# Altium schematic sheet CameraCageBB.SchDoc: CameraCageBB
size B; Date: 10/05/2022; Author: Jonah Mikesell; Organization: ORGANIZATION; Address1: ADDRESS 1; Address2: ADDRESS 2; Address3: ADDRESS 3; Address4: ADDRESS 4; Revision: 0; SheetNumber: 1; SheetTotal: 1; ENG_APP_DATE: --/--/--; DSN_APP_DATE: --/--/--; CHK_APP_DATE: --/--/--
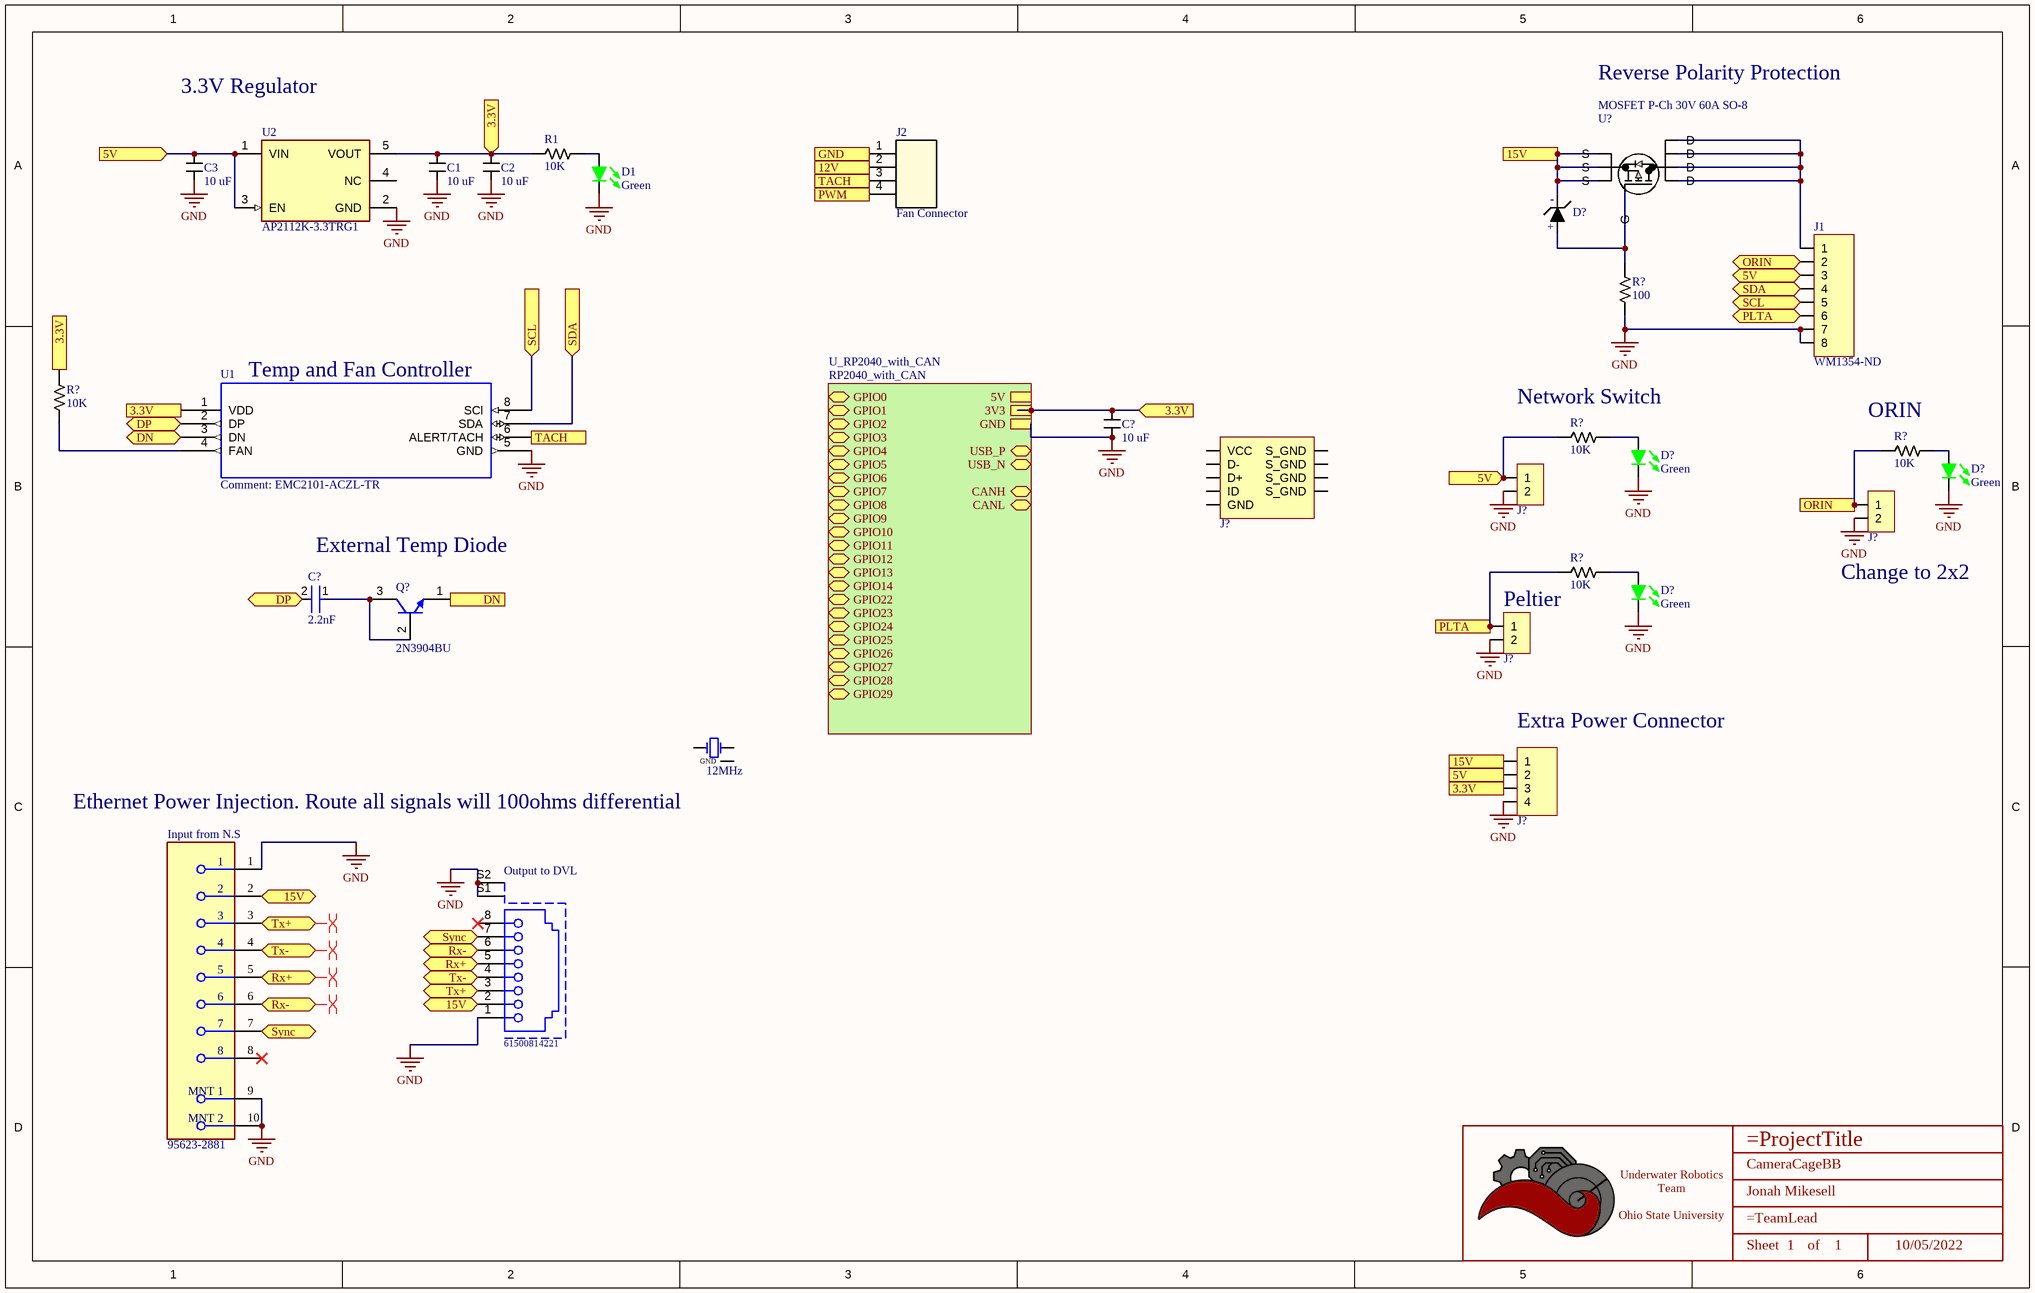
[diagram p0: CameraCageBB.SchDoc]

## Parts
(Parts that share a designator on the sheet are numbered #1, #2 ... from top to bottom, then left to right.)
12MHz  CRYSTAL 12.0000MHZ 18PF SMD  [4-SMD No Lead Crystal]  (value not drawn)
*  Title_Block  [LOGO]  (value not drawn)  (graphical)
C1  Value (uF): 10 uF  [CAPACITOR_0603]  (hidden comment: 10uF Ceramic 6.3V)
C2  Value (uF): 10 uF  [CAPACITOR_0603]  (hidden comment: 10uF Ceramic 6.3V)
C3  Value (uF): 10 uF  [CAPACITOR_0603]  (hidden comment: 10uF Ceramic 6.3V)
C?#1  Value (uF): 10 uF  [CAPACITOR_0603]  (hidden comment: 10uF Ceramic 6.3V)
C?#2  2.2nF  [FP-GRM188-0_1-e0_2_0_5-MFG]
D1  Color: Green  [LED_0603]  (hidden comment: IN-S63AT5G)
D?#1  Zener_Diode_10V_410mW  [SOD-123]  (value not drawn)
D?#2  Color: Green  [LED_0603]  (hidden comment: IN-S63AT5G)
D?#3  Color: Green  [LED_0603]  (hidden comment: IN-S63AT5G)
D?#4  Color: Green  [LED_0603]  (hidden comment: IN-S63AT5G)
Input_from_N.S  95623-2881  [FP-95623-2881-MFG]
J1  Supplier Part Number 1: WM1354-ND  [CONN_MOLEX_MINIFIT JR_8 POS_R/A]  (hidden comment: 8 POS R/A)
J2  Fan Connector  [CONN_B4B-XH-AM_JST]
J?#1  USB_MICRO R/A  [CONN_MINIUSB]  (value not drawn)
J?#2  2 POS  [HEADER_2PIN_2.54MM]  (value not drawn)
J?#3  2 POS  [HEADER_2PIN_2.54MM]  (value not drawn)
J?#4  2 POS  [HEADER_2PIN_2.54MM]  (value not drawn)
J?#5  4 POS R/A  [CONN_MOLEX_MINIFIT JR_4 POS_R/A]  (value not drawn)
Output_to_DVL  61500814221  [61500814221]
Q?  2N3904BU  [FAIR-TO-92]
R1  Value  (Ohms): 10K  [RESISTOR_0603]  (hidden comment: 10k Ohm 5% 1/10W)
R?#1  Value  (Ohms): 100  [RESISTOR_0603]  (hidden comment: 100 Ohm 5% 1/8W)
R?#2  Value  (Ohms): 10K  [RESISTOR_0603]  (hidden comment: 10k Ohm 5% 1/10W)
R?#3  Value  (Ohms): 10K  [RESISTOR_0603]  (hidden comment: 10k Ohm 5% 1/10W)
R?#4  Value  (Ohms): 10K  [RESISTOR_0603]  (hidden comment: 10k Ohm 5% 1/10W)
R?#5  Value  (Ohms): 10K  [RESISTOR_0603]  (hidden comment: 10k Ohm 5% 1/10W)
U1  EMC2101-ACZL-TR  [MSOP-8_MS]
U2  AP2112K-3.3TRG1  [FP-SOT25-IPC_A]
U?  MOSFET P-Ch 30V 60A SO-8  [MOSFET_7DP-T1-GE3_VIS]

## Sub-sheets
U_RP2040_with_CAN = RP2040_with_CAN: USB_P (bidir), USB_N (bidir), 5V, CANH (bidir), CANL (bidir), GPIO0 (bidir), GPIO1 (bidir), GPIO2 (bidir), GPIO3 (bidir), GPIO4 (bidir), GPIO5 (bidir), GPIO6 (bidir), GPIO7 (bidir), GPIO8 (bidir), GPIO9 (bidir), GPIO10 (bidir), GPIO11 (bidir), GPIO12 (bidir), GPIO13 (bidir), GPIO14 (bidir), GPIO22 (bidir), GPIO23 (bidir), GPIO24 (bidir), GPIO25 (bidir), GPIO26 (bidir), GPIO27 (bidir), GPIO28 (bidir), GPIO29 (bidir), 3V3, GND

## Ports
3.3V, 3.3V (in), 5V, 5V (bidir), 5V (in), 12V (in), 15V, 15V (bidir), 15V (out), DN, DN (bidir), DP (bidir), GND (out), ORIN, ORIN (bidir), PLTA, PLTA (bidir), PWM (out), Rx+ (bidir), Rx- (bidir), SCL (bidir), SCL (in), SDA (bidir), SDA (in), Sync (bidir), TACH (out), Tx+ (bidir), Tx- (bidir)

## Nets
GND: C1.2 C2.2 C3.2 C?#1.2 D1.2 D?#2.2 D?#3.2 D?#4.2 Input_from_N.S.1 Input_from_N.S.9(MNT_1) Input_from_N.S.10(MNT_2) J1.7 J1.8 J?#2.2 J?#3.2 J?#4.2 J?#5.4 Output_to_DVL.1 Output_to_DVL.S1 Output_to_DVL.S2 R?#1.2 U1.5(GND) U2.2(GND) ; sheet U_RP2040_with_CAN/GND
3.3V: C1.1 C2.1 C?#1.1 J?#5.3 R1.2 R?#2.1 U1.1(VDD) U2.5(VOUT) ; port 3.3V, sheet U_RP2040_with_CAN/3V3
5V: C3.1 J1.3 J?#2.1 J?#5.2 R?#3.2 U2.1(VIN) U2.3(EN) ; port 5V
12V: J2.2 ; port 12V
15V: D?#1.2 Input_from_N.S.2 J?#5.1 Output_to_DVL.2 ; port 15V
DN: Q?.1(E) U1.3(DN) ; port DN
DP: C?#2.2 U1.2(DP) ; port DP
GND: J2.1 ; port GND  [a separate net that carries the same name]
ORIN: J1.2 J?#3.1 R?#4.2 ; port ORIN
PLTA: J1.6 J?#4.1 R?#5.2 ; port PLTA
PWM: J2.4 ; port PWM
Rx+: Input_from_N.S.5 Output_to_DVL.5 ; port Rx+
Rx-: Input_from_N.S.6 Output_to_DVL.6 ; port Rx-
SCL: J1.5 U1.8(SCl) ; port SCL
SDA: J1.4 U1.7(SDA) ; port SDA
Sync: Input_from_N.S.7 Output_to_DVL.7 ; port Sync
TACH: J2.3 U1.6(ALERT/TACH) ; port TACH
Tx+: Input_from_N.S.3 Output_to_DVL.3 ; port Tx+
Tx-: Input_from_N.S.4 Output_to_DVL.4 ; port Tx-
NetC?#2_1: C?#2.1 Q?.2(B) Q?.3(C)
NetD1_1: D1.1 R1.1
NetD?#1_1: D?#1.1 R?#1.1 U?.4(G)
NetD?#2_1: D?#2.1 R?#3.1
NetD?#3_1: D?#3.1 R?#4.1
NetD?#4_1: D?#4.1 R?#5.1
NetR?#2_2: R?#2.2 U1.4(FAN)

Not connected (* = marked no-connect by the designer): 12MHz 1 2 GND; Input_from_N.S 8*; J1 1; J?#1 1(VCC) 2(D-) 3(D+) 4(ID) 5(GND) 6(S_GND) 7(S_GND) 8(S_GND) 9(S_GND); Output_to_DVL 8*; U2 4(NC); U? 1(S) 2(S) 3(S) 5(D) 6(D) 7(D) 8(D)

## Layout directives
differential pair: Rx+, Rx-, Tx+, Tx-

## Notes on the sheet
- 3.3V Regulator
- Reverse Polarity Protection
- (near U1) Temp and Fan Controller
- Network Switch
- (near R?#4) ORIN
- External Temp Diode
- Peltier
- (near J?#3) Change to 2x2
- (near J?#5) Extra Power Connector
- (near 12MHz) Ethernet Power Injection. Route all signals will 100ohms differential
- DWG. NO.
- REV.
- SHT.
- THIS DOCUMENT AND THE DATA DISCLOSED HEREIN OR HEREWITH IS THE PROPERTY OF ALTIUM LIMITED AND MAY BE FREELY DISTRIBUTED IN WHOLE. NO RIGHTS ARE RESERVED OR EXPRESS OR IMPLIED WARANTEE GIVEN.
- REVISION
- DESCRIPTION
- DATE
- APPROVED
- ENG:
- APPROVALS
- PROJECT
- DSN:
- CHK:
- REFERENCE DOCUMENTS
- PROJECT REVISION:
- TITLE
- DOCUMENT REVISION:
- DESIGN ITEM:
- BOM:
- FAB DWG:
- PCB DWG:
- ASSY DWG:
- SCALE:
- SIZE
- B
- CAGE CODE
- FILE NAME
- DWG NO.
- SHEET
- OF
- REV
- (in symbol Title_Block) Underwater Robotics Team / Ohio State University; Sheet; of
- (in symbol Zener_Diode_10V_410mW) -; +

## Library data of the parts
12MHz = CRYSTAL_12MHz_SMD: 12 MHz ±20ppm Crystal 18pF (6x3.5mm); pin to pad: 2>3 GND>2+4; Made By: Robert Pafford; Frequency: 12 MHz; ESR: 50 Ohmz; Load Capacitance: 18pF; Supplier 1: Digi-Key; Supplier Part Number 1: XC3080CT-ND
* = Title_Block: UWRT Schematic Title Block Template / Created June 2021, Dylan Trainor
C1-C3 C?#1 = CAPACITOR_10uF_0603: Cap 10uF 6.3V +/-20% / Ceramic 0603; Made By: Flip B; ComponentLink1Description: Digikey; ComponentLink1URL: https://www.digikey.com/en/products/detail/samsung-electro-mechanics/CL10A106MQ8NNNC/3886777; Supplier 1: Digi-Key; Supplier Part Number 1: 1276-1119-1-ND; Tolerance: +/- 20%; Voltage: 6.3V
C?#2 = CMP-06035-056041-1: Chip Multilayer Ceramic Capacitors for General Purpose, 0603, 2200pF, C0G, 30ppm/°C, 5%, 50V; Insulation Resistance: 10GR; Min Operating Temperature: -55°C; Voltage: 50V; Tolerance: 5%; Height: 0.8mm; Packaging: Tape and Reel; Length: 1.6mm; Mount: Surface Mount; Temperature Coefficient: 30ppm/°C; Case Code (Metric): 1608; Case/Package: 0603; Lead Free: Lead Free; Voltage Rating: 50V; Termination: SMD/SMT; Max Operating Temperature: 125°C; Voltage Rating (DC): 50V; Number of Pins: 2; Dielectric: C0G; Material: Ceramic; Thickness: 0.035inch; REACH SVHC: No SVHC; Dielectric Material: Ceramic; Case Code (Imperial): 0603; Radiation Hardening: No; Package Quantity: 1; Capacitance: 2.2nF; Width: 0.8mm; Depth: 0.8mm
D1 D?#2-D?#4 = LED_Green_0603_3V: LED Green Vf= 3V If = 0.005A / IN-S63AT5G; Made By: Robert Pafford; Forward Current: 5mA; ComponentLink1Description: Datasheet; ComponentLink1URL: https://www.we-online.de/katalog/datasheet/150060GS75000.pdf; Forward Voltage: 3V; Package: 0603; Supplier 1: Digi-Key; Supplier Part Number 1: 1830-1062-1-ND
D?#1 = Zener_Diode_10V_410mW: Zener Diode | 10 V | 410 mW | SOD 123; Made By: Nathan A; Voltage - Zener: 10V; Power: 410mW; Package: SOD-123; Supplier 1: Digi-Key; Supplier Part Number 1: 3757-BZT52-C10_R1_00001CT-ND; ComponentLink1Description: Datasheet; ComponentLink1URL: https://www.panjit.com.tw/upload/datasheet/BZT52-C2V4_SERIES.pdf
Input_from_N.S = CMP-04778-000006-1: CONN MOD JACK 8P8C VERT SHIELDED; Number of Positions: 8; Connector Type: RJ45; Current Rating: 1.5A; Number of Ports: 1; Pitch: 2.54mm; Gender: Female; Voltage Rating (AC): 125V; Packaging: Tray; Halogen Free: Low Halogen; Contact Material: Bronze; Radiation Hardening: No; Length: 16.6mm; Mount: Through Hole; Package Quantity: 2016; Series: 95623; Housing Material: Thermoplastic; Shielding: Shielded; Width: 16.6mm; Contact Plating: Gold; Housing Color: Black; Number of Contacts: 8; Min Operating Temperature: -40°C; Termination: Through Hole; Number of Positions Loaded: 8; Max Operating Temperature: 80°C; Depth: 16.5mm; Orientation: Straight
J1 = CONN_MOLEX_MINIFIT JR_8POS_R/A: Molex Minifit Jr. 5569 / 8 Pos R/A Natural; Pitch: 4.2mm; Configuration: Right Angle; Current Per Pin: 13A; Number of Positions: 8; Manufacturer: Molex; Color: Natural; Created By: Flip B; ComponentLink1Description: Datasheet; ComponentLink1URL: https://www.molex.com/pdm_docs/ps/PS-5556-001.pdf; Series: Minifit Jr 5569; Supplier 1: Digi-Key
J2 = B4B-XH-AM(LF)(SN): Connector Header Through Hole 4 position 0.098" (2.50mm); Vendor: JST; SourceLibrary: Add_to_database_2020-12-30; Datasheet: http://www.jst-mfg.com/product/pdf/eng/eXH.pdf; Manufacturer_Part_Number: B4B-XH-AM(LF)(SN); Supplier 1: Digi-Key; Supplier Part Number 1: 455-2237-ND; Created By: Dylan Trainor; Verified By: *
J?#1 = CONN_MICROUSB: Amphenol Micro USB-B / USB2.0 5 Pin Right Angle SMD; Pitch: 0.65mm; Current Per Pin: 1.8A; Number of Positions: 5; Manufacturer: Amphenol; Configuration: Right Angle; Color: Silver; Created By: Flip B; ComponentLink1Description: Datasheet; ComponentLink1URL: https://cdn.amphenol-icc.com/media/wysiwyg/files/documentation/datasheet/inputoutput/io_usb_micro.pdf?__cf_chl_jschl_tk__=05693735e19256298f6ef6ca2bb2e65c376a4f56-1625503833-0-Abitsb0-ufjOXJYs_S3J3r2iTn-nObalbmXUksF1VvO_h_WEmRdMlUD1I8-hmWSEVWzY1pirKnrPZWfgY3851qyBZe5ZvnNQePLGIzUgdEIQBVUyW36RsbYpDLEWxJ4horD-5gChFgobLYqwmG5aHl0E8lIn_twwPPrOxilK2gP0q9t_CNOs_u5fMqXvXUrlsOv8tIE2NRlu6NVP8qtkL2GjhlkeTUbDMF8WvvpPDTFOgvZ4Y16Ej8F8AhWos88mo5B1HssXozw0XrkJQIqERITUu6rqloz9kf4ZzhBHtDAt-IkiAFY_Ds9SW8FYKKTtINJVpHZQ6Gyu1FFM4Dc9MO0maE8_mmNcwlxqyRoRk_MPWW8VyByXWM5RSp52jteRKw7FeI9WIYvCbPAOy0Eyib-aseIQsnGbglBcUY6_2xp8GYaJM38H3dNvBPsSOfJBPndKedwKHllxjkucXn6xsN0sDXkpGN-cu8_2bDTJ0g-uUucKSCooYX-ApSDNGpkA_p9zv1SOAD8c0zaZVmtiBsN75QpVz2rzq9_BFxOywPvR; Series: 10118192; Supplier 1: Digi-Key; Supplier Part Number 1: 609-4613-1-ND
J?#2-J?#4 = HEADER_2PIN_2.54MM: CONN HEADER VERT 2POS 2.54MM; Configuration: Vertical; Current Per Pin: 1A; Number of Positions: 2; Manufacturer: *; Pitch: 2.54mm; Color: Natural; Created By: Robert P; ComponentLink1Description: Datasheet; ComponentLink1URL: https://www.molex.com/pdm_docs/sd/026013115_sd.pdf; Series: *; Supplier 1: Digi-Key; Supplier Part Number 1: A121480-ND; Supplier 2: Mouser; Supplier Part Number 2: 571-5-146280-2
J?#5 = CONN_MOLEX_MINIFIT JR_4POS_R/A: Molex Minifit Jr. 5569 / 4 Pos R/A Natural; Pitch: 4.2mm; Configuration: Right Angle; Current Per Pin: 13A; Number of Positions: 4; Supplier Part Number 1: WM13112-ND; Supplier 1: Digi-Key; Manufacturer: Molex; Color: Natural; Created By: Flip B; ComponentLink1Description: Datasheet; ComponentLink1URL: https://www.molex.com/pdm_docs/sd/026013115_sd.pdf; Series: Minifit Jr 5569
Output_to_DVL = CMP-1502-01695-1: Modular Jack WR-MJ, Tab Down, Shielded, Horizontal Entry, THT, 8P8C; Manufacturer: Wurth Elektronik; Withstanding Voltage: 1000VAC; Contact Resistance: 20mOhm; Rated Current: 1.5A; Compliance: Leadfree/RoHS; Port: 1x1; Working Voltage: 120VAC; Entrance: Horizontal; Package Reference: 61500814221; Datasheet URL: https://katalog.we-online.de/em/datasheet/61500814221.pdf; Pin Number: 8P8C; Operating Temperature: -40to85degC; Manufacturer URL: http://www.we-online.de; Packaging: Tray; Publisher: WurthElektronik; Part Number: 61500814221; Mounting Technology: THT
Q? = CMP-2000-04944-1: NPN General-Purpose Amplifier, 40 V VCEO, 0.2 A, -55 to 150 degC, 2-Pin TO-92, RoHS, Bulk; Manufacturer: FairchildSemiconductor; Maximum Collector Base Voltage: 60V; Minimum DC Current Gain: 40@0.1mA@1V; Maximum Collector Emitter Voltage: 40V; Maximum DC Collector Current: 0.2A; Rad Hard: No; Maximum Operating Frequency: 300(Min)MHz; Maximum Collector Emitter Saturation Voltage: 0.2@1mA@10mA; Maximum Power Dissipation: 625mW; Package Description: 3-Pin Transistor Outline Package, Body Dia 4.79 mm, Pitch 1.27 mm; Package Reference: TO-92; Pin Count: 3; Operating Temperature: -55to150degC; Category: GPBJT; Manufacturer URL: https://www.fairchildsemi.com/; Datasheet URL: https://datasheet.ciiva.com/4722/2n3904-82270-4722369.pdf; Package: 3TO-92; Packaging: Bulk; Type: NPN; Datasheet Version: Rev. 1.1.0, 10/2014; Mounting: ThroughHole
R1 R?#2-R?#5 = RESISTOR_10K_0603: RES 10k OHM 5% 1/10W 0603; Tolerance: +/- 5%; Wattage: 1/8W; Made By: Robert Pafford; ComponentLink1Description: Datasheet; ComponentLink1URL: https://www.bourns.com/docs/product-datasheets/CRxxxxx.pdf; Supplier: Digikey; Digikey Part Numer: CR0603-JW-104ELFTR-ND; Supplier 1: Digi-Key; Supplier Part Number 1: 2019-RK73B1JTTD103JCT-ND
R?#1 = RESISTOR_100_0603: RES 100 OHM 5% 1/8W 0603; Tolerance: +/- 5%; Made By: Flip B; ComponentLink1Description: Digikey; ComponentLink1URL: https://www.digikey.com/en/products/detail/koa-speer-electronics-inc/RK73B1JTTD101J/9844701; Supplier 1: Digi-Key; Supplier Part Number 1: 2019-RK73B1JTTD101JCT-ND; Wattage: 1/8W
U1 = LTC4359CMS8PBF: IC OR CTRLR N+1 8MSOP,  IDEAL DIODE CONTROLLER; MF: Linear Technology; MP: LTC4359CMS8#PBF; Package: MSOP-8 Linear Technology; SnapEDA_Link: https://www.snapeda.com/parts/LTC4359CMS8%23PBF/Analog%20Devices/view-part/448959/?ref=snap; Mouser-Purchase-URL: https://snapeda.com/shop?store=Mouser&id=448959; DigiKey-Purchase-URL: https://snapeda.com/shop?store=DigiKey&id=448959; Price: None; Availability: Unavailable; Value: *; Supplier 1: Digi-Key; Supplier Part Number 1: EMC2101-ACZL-CT-ND; Supplier 2: Mouser; Supplier Part Number 2: 886-EMC2101-ACZL-TR
U2 = CMP-12756-000035-1: IC REG LINEAR 3.3V 600MA SOT25; Number of Regulators: 1; Output Type: Fixed; Polarity: Positive; Min Input Voltage: 2.5V; Max Input Voltage: 6V; Accuracy: 1.5%; Quiescent Current: 55uA; Dropout Voltage: 250mV; Min Operating Temperature: -40°C; Length: 3.1mm; Output Current: 600mA; Max Operating Temperature: 85°C; Package Quantity: 1; Output Voltage: 3.3V; Width: 1.7mm; Number of Outputs: 1; Packaging: Tape and Reel; Height: 1.3mm; Lead Free: Lead Free; Max Output Current: 600mA; Case/Package: SOT-23-5; Mount: Surface Mount; Number of Pins: 5
U? = SIR167DP-T1-GE3: P-Channel 30 V 60A (Tc) 65.8W (Tc) Surface Mount PowerPAK® SO-8; Mfr_Name: Vishay; Copyright: Copyright (C) 2022 Ultra Librarian. All rights reserved.; Manufacturer_Part_Number: SIR167DP-T1-GE3; RefDes: RefDes; Type: DEV